# EAGLE design Schematic_diagram (EAGLE 9.5.2)
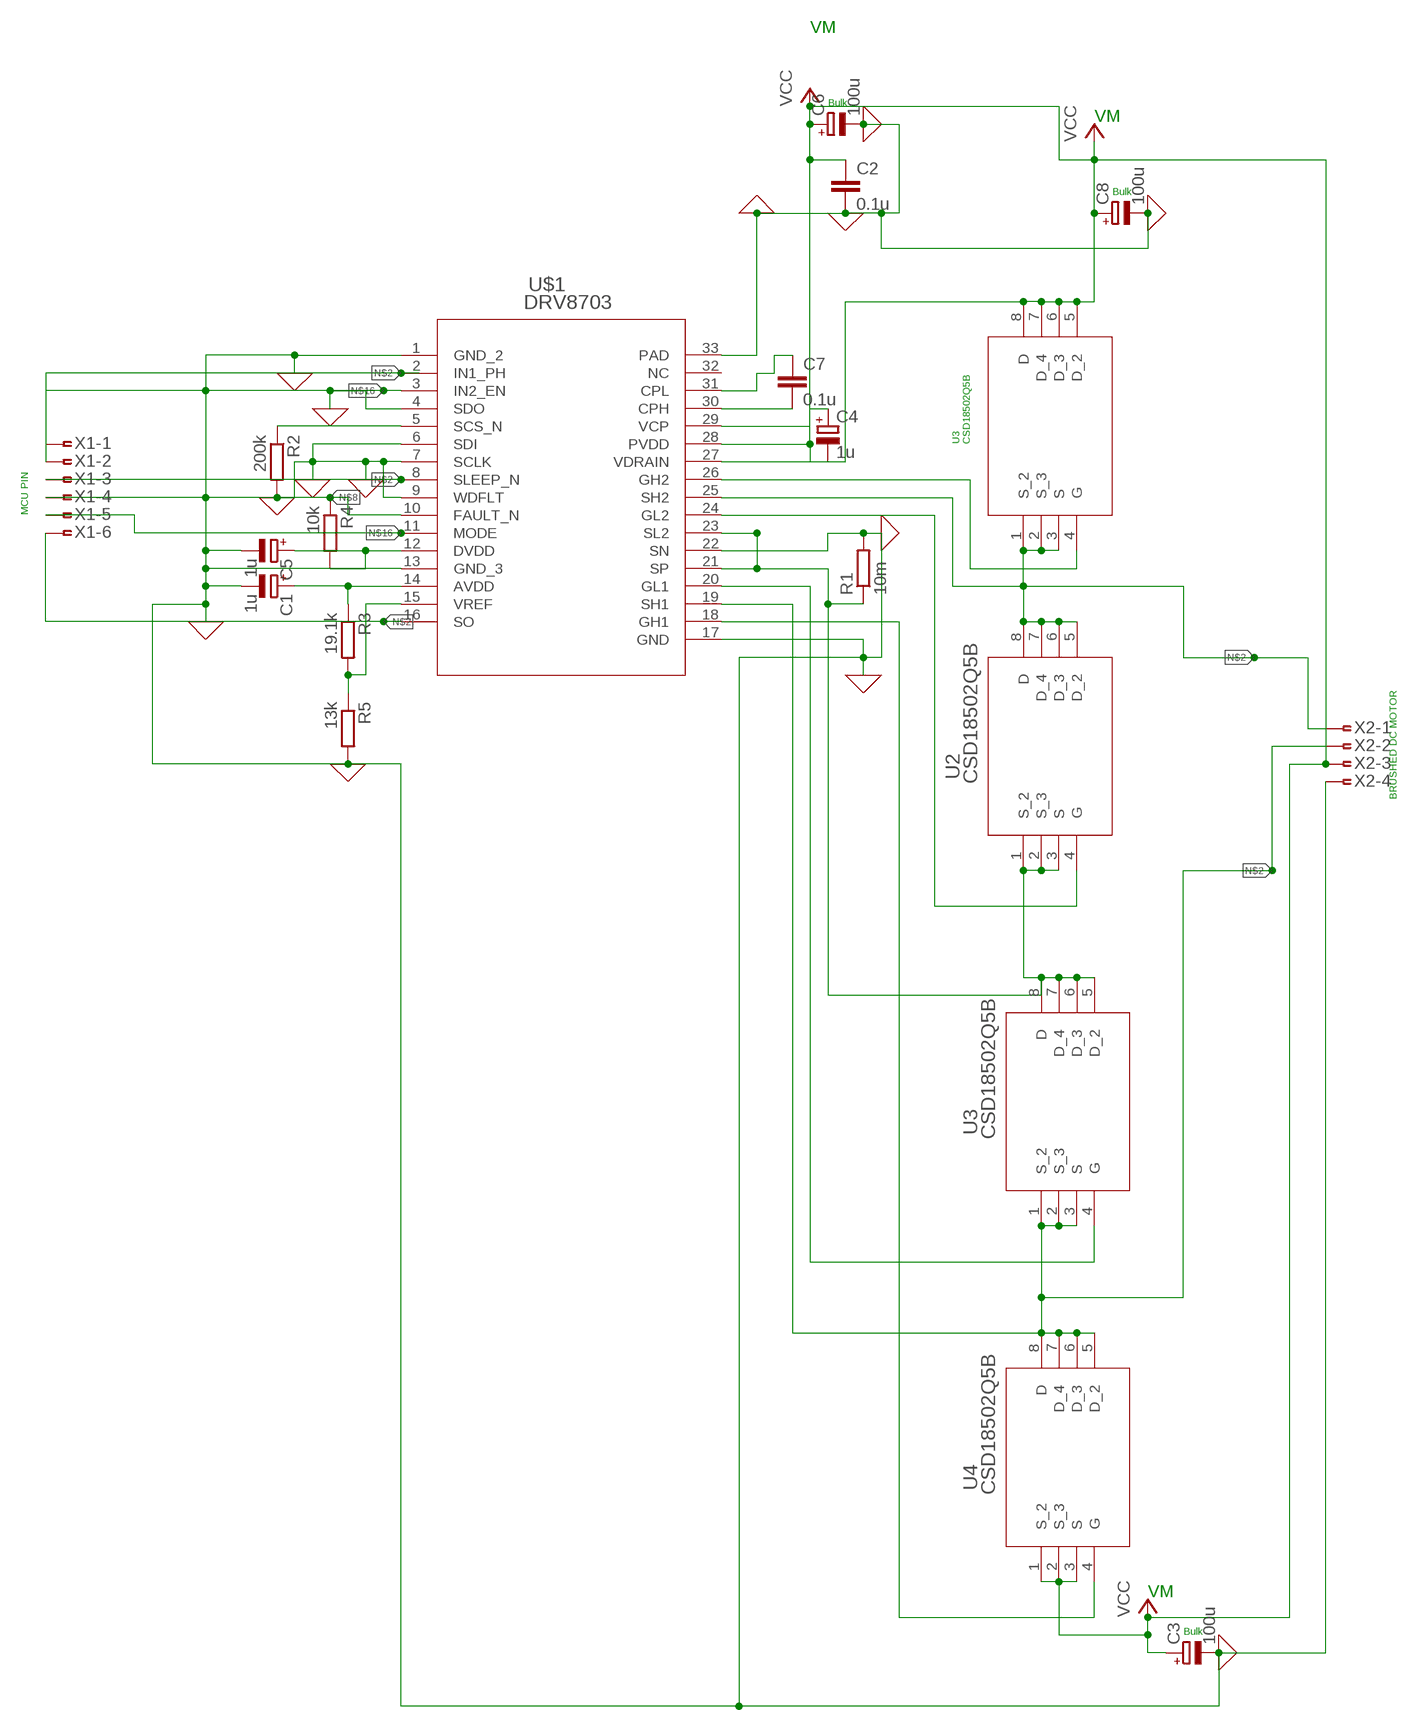
[diagram p0: schematic, sheet 1]

## Parts
C1  1u  CPOL-EUE5-5  [E5-5]
C2  0.1u  C-EUC0805K  [C0805K]
C3  100u  CPOL-EUE5-10.5  [E5-10,5]
C4  1u  CPOL-EUE5-5  [E5-5]
C5  1u  CPOL-EUE5-5  [E5-5]
C6  100u  CPOL-EUE5-10.5  [E5-10,5]
C7  0.1u  C-EUC0805K  [C0805K]
C8  100u  CPOL-EUE5-10.5  [E5-10,5]
R1  10m  R-EU_0207/7  [0207/7]
R2  200k  R-EU_0207/7  [0207/7]
R3  19.1k  R-EU_0207/7  [0207/7]
R4  10k  R-EU_0207/7  [0207/7]
R5  13k  R-EU_0207/7  [0207/7]
U1  CSD18502Q5B  [DNK8]
U2  CSD18502Q5B  [DNK8]
U3  CSD18502Q5B  [DNK8]
U4  CSD18502Q5B  [DNK8]
U$1  DRV8703  [RHB0032E]
X1  FTOP-6  [FTOP-6]
X2  FTOP-4  [FTOP-4]

## Nets
0: C1.- C2.2 C3.- C5.+ C5.- C6.- C8.- R1.1 R1.2 R2.2 R4.2 R5.2 U2.1(S_2) U2.2(S_3) U2.3(S) U3.5(D_2) U3.6(D_3) U3.7(D_4) U3.8(D) U$1.1(GND_2) U$1.4(SDO) U$1.6(SDI) U$1.7(SCLK) U$1.9(WDFLT) U$1.12(DVDD) U$1.13(GND_3) U$1.17(GND) U$1.21(SP) U$1.22(SN) U$1.23(SL2) U$1.33(PAD) X2.4 ; supply symbol labelled GND
N$1: U1.1(S_2) U1.2(S_3) U1.3(S) U2.5(D_2) U2.6(D_3) U2.7(D_4) U2.8(D) U$1.25(SH2) X2.1
N$2: U$1.2(IN1_PH) X1.1
N$3: U4.4(G) U$1.18(GH1)
N$4: U3.1(S_2) U3.2(S_3) U3.3(S) U4.5(D_2) U4.6(D_3) U4.7(D_4) U4.8(D) U$1.19(SH1) X2.2
N$5: U3.4(G) U$1.20(GL1)
N$6: R2.1 U$1.5(SCS_N)
N$7: U2.4(G) U$1.24(GL2)
N$8: R4.1 U$1.10(FAULT_N) X1.4
N$10: U1.4(G) U$1.26(GH2)
N$11: R3.2 R5.1 U$1.15(VREF)
N$12: C1.+ R3.1 U$1.14(AVDD)
N$13: C7.1 U$1.31(CPL)
N$14: C7.2 U$1.30(CPH)
N$15: C4.+ U$1.29(VCP)
N$16: U$1.3(IN2_EN) X1.2
N$17: U$1.8(SLEEP_N) X1.3
N$19: U$1.16(SO) X1.6
N$20: U$1.11(MODE) X1.5
VCC: C2.1 C3.+ C4.- C6.+ C8.+ U1.5(D_2) U1.6(D_3) U1.7(D_4) U1.8(D) U4.1(S_2) U4.2(S_3) U4.3(S) U$1.27(VDRAIN) U$1.28(PVDD) X2.3
Unconnected: U$1.32(NC)

## Notes on the sheet
- VM
- Bulk
- VM
- Bulk
- U3
  CSD18502Q5B
- MCU PIN
- BRUSHED DC MOTOR
- VM | Bulk

## Library data of the parts
C1 C3-C6 C8 = rcl:CPOL-EU: POLARIZED CAPACITOR, European symbol; SPICEPREFIX: C
C2 C7 = rcl:C-EU: CAPACITOR, European symbol; SPICEPREFIX: C
R1-R5 = rcl:R-EU_: RESISTOR, European symbol; SPICEPREFIX: R
U1-U4 = csd18502q5b:CSD18502Q5B; BUILT_BY: EMA_UL_Team; MANUFACTURER_PART_NUMBER: CSD18502Q5B; VENDOR: Texas Instruments
U$1 = drv8703:DRV8703
X1 = con-amp:FTOP-6: AMP connector
X2 = con-amp:FTOP-4: AMP connector

## Board
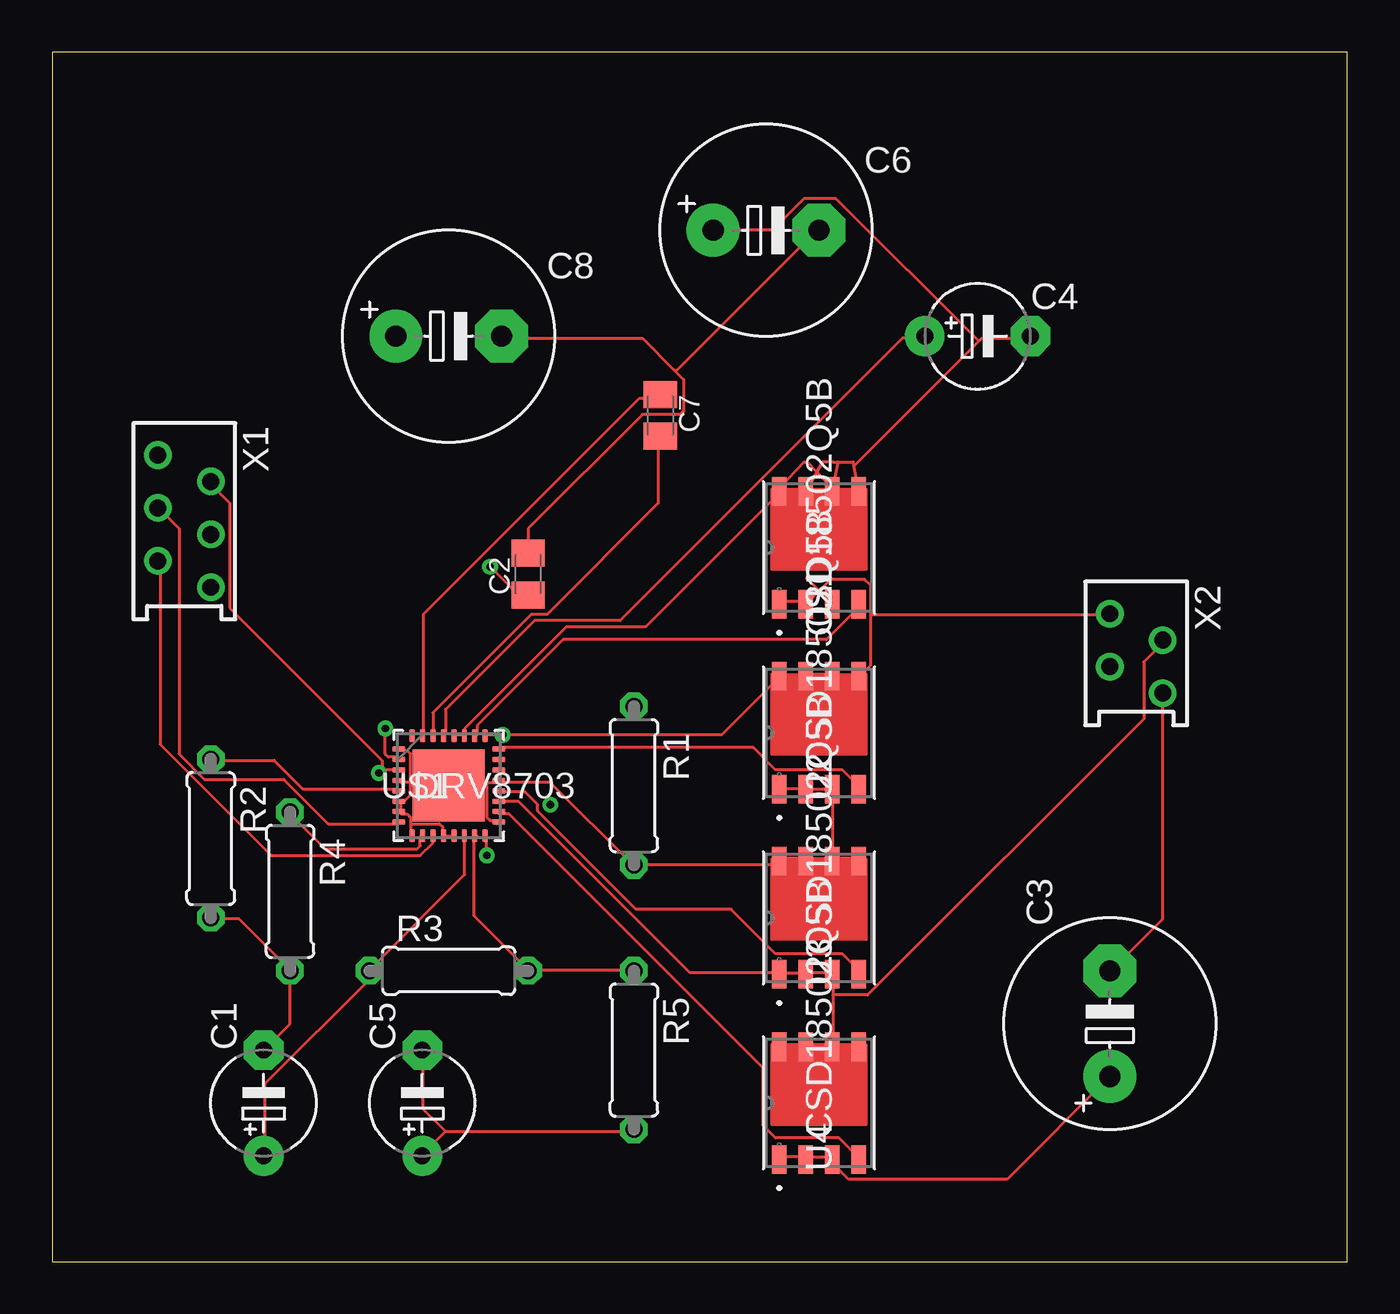
[diagram p1: board, top side]
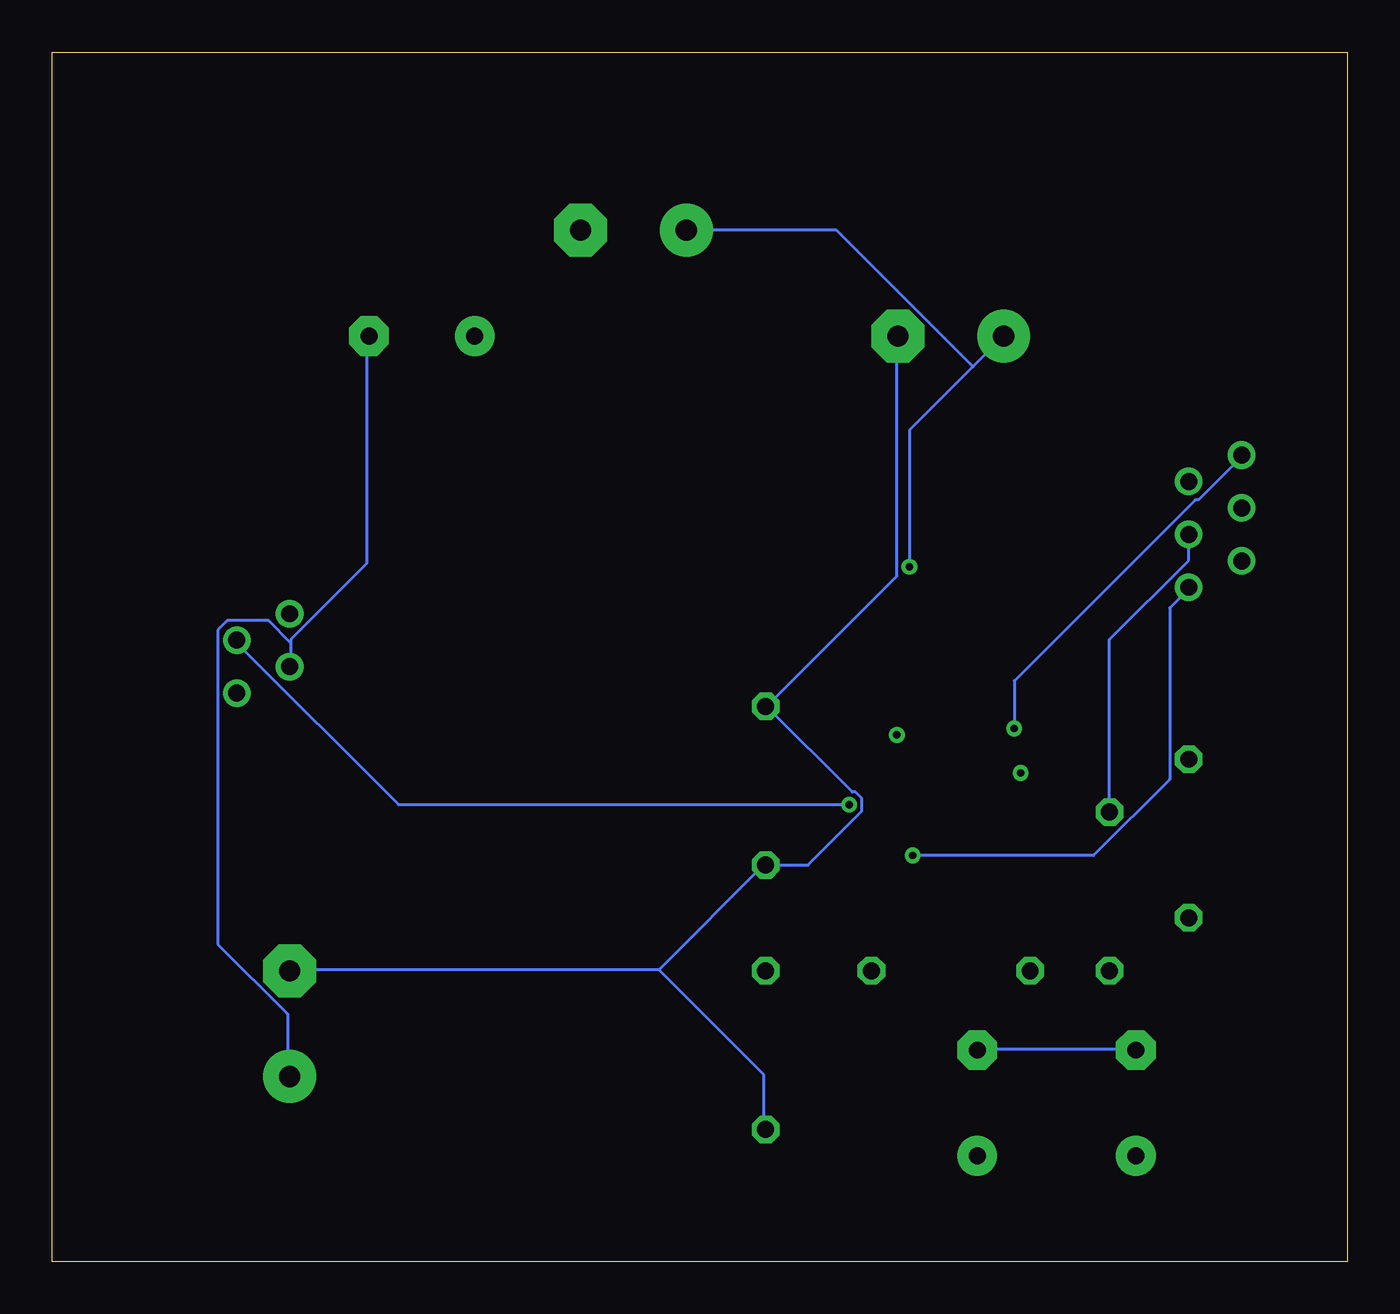
[diagram p2: board, bottom side, seen from below]

Size 62.21 x 58.09 mm. Coordinates in mm from the lower left corner, seen from the top.
Outline: 0,0 62.21,0 62.21,58.09 0,58.09 0,0
Copper layers (1*16): Top 0.035mm / dielectric 1.5mm / Bottom 0.035mm
Design rules "default": minimum track width 6mil, minimum drill 0.35mm, track to track 6mil, track to pad 6mil, pad to pad 6mil, via to via 6mil, smd to smd 6mil, copper to edge 40mil, drill to drill 6mil, minimum pad ring 10mil, minimum via ring 8mil, stop-mask expansion 4mil, vias tented up to drill 0mil, thermal gap 10mil

### Footprints (pad centres in the part's own frame; a part is rotated, then mirrored left to right if it is on the bottom)
E5-5 = drill 0.813 pad 1.905: + -2.54,0 | drill 0.813 pad 1.905 octagon: - 2.54,0
C0805K = smd 1.3 x 1.6: 1 -1,0; 2 1,0
E5-10,5 = drill 1.016 pad 2.54: + -2.54,0 | drill 1.016 pad 2.54 octagon: - 2.54,0
0207/7 = drill 0.813 octagon: 1 -3.81,0; 2 3.81,0
DNK8 = smd 1.372 x 0.71: 1 -2.712,1.905; 2 -2.712,0.635; 3 -2.712,-0.635; 4 -2.712,-1.905; 5 2.712,-1.905; 6 2.712,-0.635; 7 2.712,0.635; 8 2.712,1.905
RHB0032E = smd 0.61 x 0.254: 1 -2.4,1.75; 2 -2.4,1.25; 3 -2.4,0.75; 4 -2.4,0.25; 5 -2.4,-0.25; 6 -2.4,-0.75; 7 -2.4,-1.25; 8 -2.4,-1.75; 17 2.4,-1.75; 18 2.4,-1.25; 19 2.4,-0.75; 20 2.4,-0.25; 21 2.4,0.25; 22 2.4,0.75; 23 2.4,1.25; 24 2.4,1.75 | smd 0.254 x 0.61: 9 -1.75,-2.4; 10 -1.25,-2.4; 11 -0.75,-2.4; 12 -0.25,-2.4; 13 0.25,-2.4; 14 0.75,-2.4; 15 1.25,-2.4; 16 1.75,-2.4; 25 1.75,2.4; 26 1.25,2.4; 27 0.75,2.4; 28 0.25,2.4; 29 -0.25,2.4; 30 -0.75,2.4; 31 -1.25,2.4; 32 -1.75,2.4 | smd 3.454 x 3.454: 33 0,0
FTOP-6 = drill 0.813: 1 -3.175,-1.27; 2 -1.905,1.27; 3 -0.635,-1.27; 4 0.635,1.27; 5 1.905,-1.27; 6 3.175,1.27
FTOP-4 = drill 0.813: 1 -1.905,-1.27; 2 -0.635,1.27; 3 0.635,-1.27; 4 1.905,1.27

### Placement (x,y rotation side)
C1  10.16,7.62 90 top
C2  22.86,33.02 90 top
C3  50.8,11.43 90 top
C4  44.45,44.45 0 top
C5  17.78,7.62 90 top
C6  34.29,49.53 0 top
C7  29.21,40.64 270 top
C8  19.05,44.45 0 top
R1  27.94,22.86 270 top
R2  7.62,20.32 270 top
R3  19.05,13.97 0 top
R4  11.43,17.78 270 top
R5  27.94,10.16 270 top
U1  36.83,34.29 90 top
U2  36.83,25.4 90 top
U3  36.83,16.51 90 top
U4  36.83,7.62 90 top
U$1  19.05,22.86 0 top
X1  6.35,35.56 270 top
X2  52.07,29.21 270 top

### Tracks (layer width: path | path; a pad name or v marks a point on that pad's centre or on a via)
0
  Top 0.152: U$1.7 16.76,21.49 17.07,21.49 17.22,21.34 17.22,21.03 | 16.76,22.1 16.76,21.64 U$1.7 | 17.22,23.01 16.76,23.01 U$1.4 | 17.22,22.86 17.22,22.4 16.92,22.1 16.76,22.1 | 21.34,21.03 U$1.17 21.34,21.18 21.03,21.18 20.88,21.34 20.88,23.01 | 20.42,23.01 19.2,23.01 U$1.33 | 20.42,23.01 20.88,23.01 | 20.88,23.01 21.34,23.01 U$1.21 | 20.42,23.01 U$1.33 | U$1.33 17.22,22.86 | U3.8 35.05,19.36 36.12,19.36 U3.7 36.27,19.36 37.34,19.36 U3.6 37.49,19.36 | 37.49,19.36 38.71,19.36 U3.5 | 34.75,19.05 34.9,19.2 U3.8 | 21.49,24.23 U$1.23 21.49,24.08 21.49,23.62 | 16.61,21.49 U$1.7 | 16.76,24.69 U$1.1 16.76,24.54 17.07,24.54 17.22,24.38 17.22,23.01 | 29.87,42.82 28.35,44.35 21.64,44.35 C8.- | 29.87,42.82 30.33,42.37 30.33,40.84 30.17,40.69 28.35,40.69 22.86,35.2 22.86,34.14 C2.2 | 29.87,42.82 30.02,42.82 36.73,49.53 C6.- | C1.- 11.43,11.43 R4.2 11.43,14.02 8.99,16.46 7.62,16.46 R2.2 | 18.9,6.25 27.89,6.25 R5.2 | 18.9,6.25 17.83,5.18 C5.+ | 18.9,6.25 17.83,7.32 17.83,10.06 C5.- | X2.4 53.34,16.46 50.9,14.02 C3.- | U$1.13 19.2,20.42 18.9,20.42 U$1.12 18.74,20.57 18.74,20.88 18.59,21.03 17.22,21.03 | 17.22,21.03 17.22,20.57 U$1.9 | 17.22,22.86 17.22,23.01 | 21.49,23.62 21.49,23.16 U$1.21 | 21.49,23.62 U$1.22 | 16.76,22.1 U$1.6 | U2.1 35.05,22.71 36.12,22.71 U2.2 36.27,22.71 37.34,22.71 U2.3 37.49,22.55 37.49,19.36 | 34.75,19.05 R1.2 27.89,19.05 23.93,23.01 21.49,23.01 U$1.21 | 34.75,19.05 U3.8
  Bottom 0.152: 10.11,10.26 C1.- 10.21,10.21 17.68,10.21 C5.- | 50.8,14.07 C3.- 50.75,14.02 33.07,14.02 | 27.89,26.67 23.77,22.55 23.62,22.55 23.32,22.25 23.32,21.64 25.91,19.05 R1.2 28.04,19.05 33.07,14.02 | 33.07,14.02 28.04,8.99 28.04,6.4 R5.2 | 27.89,26.67 21.64,32.92 21.64,44.35 C8.- | 27.89,26.67 R1.1
N$1  (via drill 0.35)
  Top 0.152: 36.12,31.65 U1.2 | U1.2 37.43,32.82 | 37.43,32.82 37.34,32.92 36.27,32.92 36.22,32.82 U1.3 37.49,31.5 | U1.1 35.05,31.7 36.12,31.7 U1.2 | U$1.25 20.88,25.3 v21.64,25.3 32.16,25.3 34.9,28.04 U2.8 35.05,28.19 36.12,28.19 U2.7 36.27,28.19 37.34,28.19 U2.6 37.49,28.19 38.71,28.19 U2.5 38.86,28.19 39.32,28.65 39.32,31.09 | 39.32,31.09 39.32,32.46 39.01,32.77 37.49,32.77 37.43,32.82 | 39.32,31.09 50.75,31.09 X2.1
N$2  (via drill 0.35)
  Top 0.152: v16,25.6 16,24.38 16.15,24.23 16.61,24.23 U$1.2
  Bottom 0.152: v16,25.6 16,27.89 7.31,36.58 7.16,36.58 5.03,38.71 X1.1
N$3
  Top 0.152: 38.86,4.93 U4.4 38.71,5.03 37.8,5.94 34.75,5.94 34.14,6.55 34.14,9.3 21.95,21.49 21.49,21.49 U$1.18
N$4  (via drill 0.35)
  Top 0.152: 35.05,10.41 U4.8 35.05,10.36 36.12,10.36 U4.7 | 36.12,10.41 U4.7 | 37.34,10.41 U4.6 | 36.27,10.41 U4.7 | 38.71,10.41 U4.5 38.71,10.36 37.49,10.36 | 37.49,10.41 U4.6 | 23.77,21.95 v23.93,21.95 | U4.7 36.27,10.36 37.34,10.36 U4.6 | U$1.19 21.49,22.1 22.4,22.1 30.63,13.87 34.9,13.87 U3.1 35.05,13.87 36.12,13.87 U3.2 36.27,13.87 37.34,13.87 U3.3 37.49,13.72 37.49,12.8 | 37.49,12.8 37.49,10.36 | 37.49,10.36 U4.6 | 37.49,12.8 39.17,12.8 52.43,26.06 52.43,28.8 53.34,29.72 X2.2
  Bottom 0.152: 23.77,22.1 v23.93,21.95 45.57,21.95 53.34,29.72 X2.2
N$5
  Top 0.152: U$1.20 21.49,22.55 22.71,22.55 23.32,21.95 23.32,21.64 28.04,16.92 32.61,16.92 34.75,14.78 37.95,14.78 38.86,13.87 U3.4
N$6
  Top 0.152: U$1.5 16.61,22.71 12.04,22.71 10.67,24.08 7.62,24.08 R2.1
N$7
  Top 0.152: U$1.24 21.49,24.69 33.68,24.69 34.75,23.62 37.95,23.62 38.86,22.71 U2.4
N$8
  Top 0.152: U$1.10 17.68,20.42 17.68,19.96 17.53,19.81 13.11,19.81 11.43,21.49 R4.1
  Bottom 0.152: 7.52,34.85 X1.4 7.62,33.68 11.43,29.87 R4.1
N$10
  Top 0.152: U$1.26 20.42,25.3 20.42,25.76 24.54,29.87 37.19,29.87 38.86,31.55 U1.4
N$11
  Top 0.152: 20.42,20.42 U$1.15 20.27,20.42 20.27,16.61 22.86,14.02 | 22.86,14.02 27.89,14.02 R5.1 | 22.86,14.02 R3.2
N$12
  Top 0.152: U$1.14 19.81,20.42 19.81,18.59 15.24,14.02 R3.1 15.24,13.56 10.21,8.53 10.21,5.18 C1.+
N$13
  Top 0.152: 29.11,41.5 C7.1 29.11,41.45 28.19,41.45 17.83,31.09 17.83,25.3 U$1.31
N$14
  Top 0.152: U$1.30 18.29,25.3 18.29,26.37 23.01,31.09 23.77,31.09 29.11,36.42 29.11,39.62 C7.2
N$15
  Top 0.152: U$1.29 18.9,25.3 18.9,26.52 23.16,30.79 27.28,30.79 40.84,44.35 41.91,44.35 C4.+
N$16  (via drill 0.35)
  Top 0.152: 15.85,23.62 16.61,23.62 U$1.3 | 15.85,23.62 15.85,24.08 8.53,31.39 8.53,36.42 7.62,37.34 X1.2 | 15.85,23.62 v15.7,23.47
N$17
  Top 0.152: U$1.8 16.61,21.03 13.26,21.03 11.12,23.16 7.31,23.16 6.1,24.38 6.1,35.2 5.18,36.12 X1.3
N$19  (via drill 0.35)
  Top 0.152: v20.88,19.51 20.88,20.42 U$1.16
  Bottom 0.152: v20.88,19.51 12.19,19.51 8.53,23.16 8.53,31.39 7.62,32.31 X1.6
N$20
  Top 0.152: U$1.11 18.29,20.42 18.29,20.12 17.68,19.51 10.52,19.51 5.18,24.84 5.18,33.53 X1.5
VCC  (via drill 0.35)
  Top 0.152: 36.12,4.93 U4.2 | 37.34,4.93 U4.3 | 36.27,4.93 U4.2 | 37.49,4.78 U4.3 | 37.34,38.41 37,38.41 36.73,37.94 | 36.73,37.94 U1.7 | 36.72,37.94 37.47,37.16 U1.6 37.73,38.41 | 36.72,37.94 36.27,38.41 36.12,38.41 34.92,37.16 U1.8 | 19.81,25.3 19.35,25.3 U$1.28 | 19.81,25.3 19.81,25.6 24.69,30.48 28.5,30.48 34.9,36.88 U1.8 | 19.81,25.3 U$1.27 | 34.9,36.98 U1.8 | 37.49,38.41 37.73,38.41 | 37.73,38.41 38.47,38.41 38.5,38.24 | 38.5,38.24 U1.5 38.86,36.98 | v21.03,33.38 22.25,32.16 22.86,32.16 C2.1 | U4.1 35.05,5.03 36.12,5.03 U4.2 | U4.3 37.34,5.03 36.27,5.03 U4.2 | C3.+ 45.87,3.96 38.25,3.96 37.49,4.72 U4.3 | 36.73,37.94 36.73,37.95 36.72,37.94 | 44.5,44.2 38.56,38.25 38.5,38.24 | 44.5,44.2 44.65,44.35 46.94,44.35 C4.- | C6.+ 34.59,49.53 36.12,51.05 37.64,51.05 44.5,44.2
  Bottom 0.152: 16.51,44.5 C8.+ 17.98,42.98 | v21.03,33.38 21.03,39.93 17.98,42.98 | C6.+ 24.54,49.53 17.98,42.98 | 50.75,29.72 50.75,29.87 47.09,33.53 47.09,44.35 C4.- | 50.75,29.72 50.75,28.65 X2.3 | 50.75,29.72 51.82,30.79 53.8,30.79 54.25,30.33 54.25,15.24 50.9,11.89 50.9,8.99 C3.+